# Altium schematic sheet 03 USB7002-PartA.SchDoc: USB7002 - Part A
size 420 x 297 mm; SheetNumber: 3; SheetTotal: 5
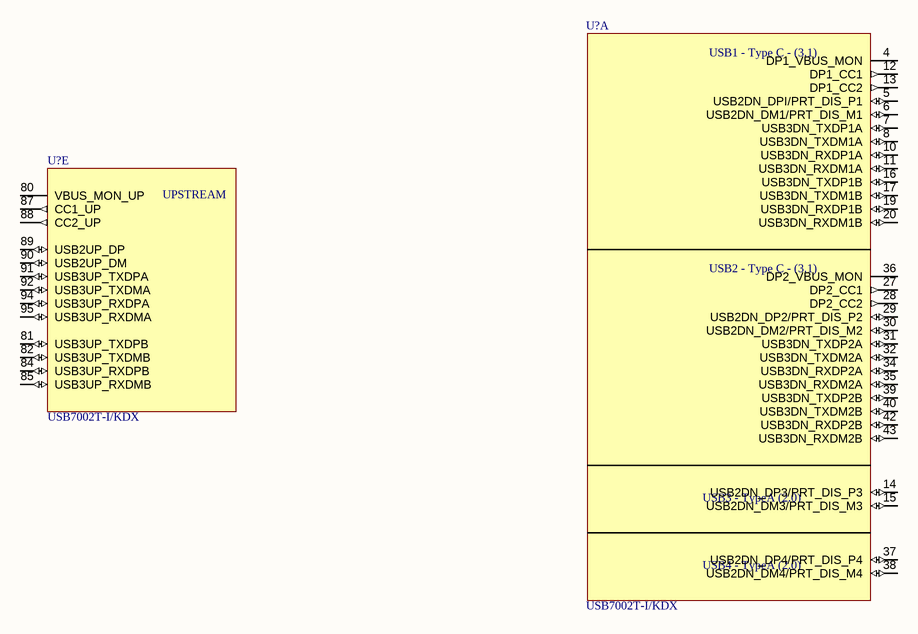
[diagram p0: 03 USB7002-PartA.SchDoc]

## Parts
(Parts that share a designator on the sheet are numbered #1, #2 ... from top to bottom, then left to right.)
U?#1  USB7002T-I/KDX  [QFN40P1200X1200X90_HS-101N]  (part E of 5)
U?#2  USB7002T-I/KDX  [QFN40P1200X1200X90_HS-101N]  (part A of 5)

## Nets

Not connected (* = marked no-connect by the designer): U?#1 80(VBUS_MON_UP) 81(USB3UP_TXDPB) 82(USB3UP_TXDMB) 84(USB3UP_RXDPB) 85(USB3UP_RXDMB) 87(CC1_UP) 88(CC2_UP) 89(USB2UP_DP) 90(USB2UP_DM) 91(USB3UP_TXDPA) 92(USB3UP_TXDMA) 94(USB3UP_RXDPA) 95(USB3UP_RXDMA); U?#2 4(DP1_VBUS_MON) 5(USB2DN_DPI/PRT_DIS_P1) 6(USB2DN_DM1/PRT_DIS_M1) 7(USB3DN_TXDP1A) 8(USB3DN_TXDM1A) 10(USB3DN_RXDP1A) 11(USB3DN_RXDM1A) 12(DP1_CC1) 13(DP1_CC2) 14(USB2DN_DP3/PRT_DIS_P3) 15(USB2DN_DM3/PRT_DIS_M3) 16(USB3DN_TXDP1B) 17(USB3DN_TXDM1B) 19(USB3DN_RXDP1B) 20(USB3DN_RXDM1B) 27(DP2_CC1) 28(DP2_CC2) 29(USB2DN_DP2/PRT_DIS_P2) 30(USB2DN_DM2/PRT_DIS_M2) 31(USB3DN_TXDP2A) 32(USB3DN_TXDM2A) 34(USB3DN_RXDP2A) 35(USB3DN_RXDM2A) 36(DP2_VBUS_MON) 37(USB2DN_DP4/PRT_DIS_P4) 38(USB2DN_DM4/PRT_DIS_M4) 39(USB3DN_TXDP2B) 40(USB3DN_TXDM2B) 42(USB3DN_RXDP2B) 43(USB3DN_RXDM2B)

## Notes on the sheet
- Title
- Project
- Size
- Date
- Revision
- A3
- Designed By
- (in symbol USB7002T-I/KDX, part A) USB1 - Type C - (3.1); USB2 - Type C - (3.1); USB3 - TypeA (2.0); USB4 - TypeA (2.0)
- (in symbol USB7002T-I/KDX, part E) UPSTREAM

## Library data of the parts
U?#1 U?#2 = USB7002T-I/KDX: USB Hub Controller USB 3.1 USB Interface 100-VQFN (12x12); manufacturer: Microchip Technology; mfr_part_number: USB7002T-I/KDX; assembler_number: USB7002T-I/KDX; datasheet: https://ww1.microchip.com/downloads/en/DeviceDoc/USB7002-Data-Sheet-DS00002670F.pdf